# EAGLE design toslink-shield-2 (EAGLE 7.5.0)
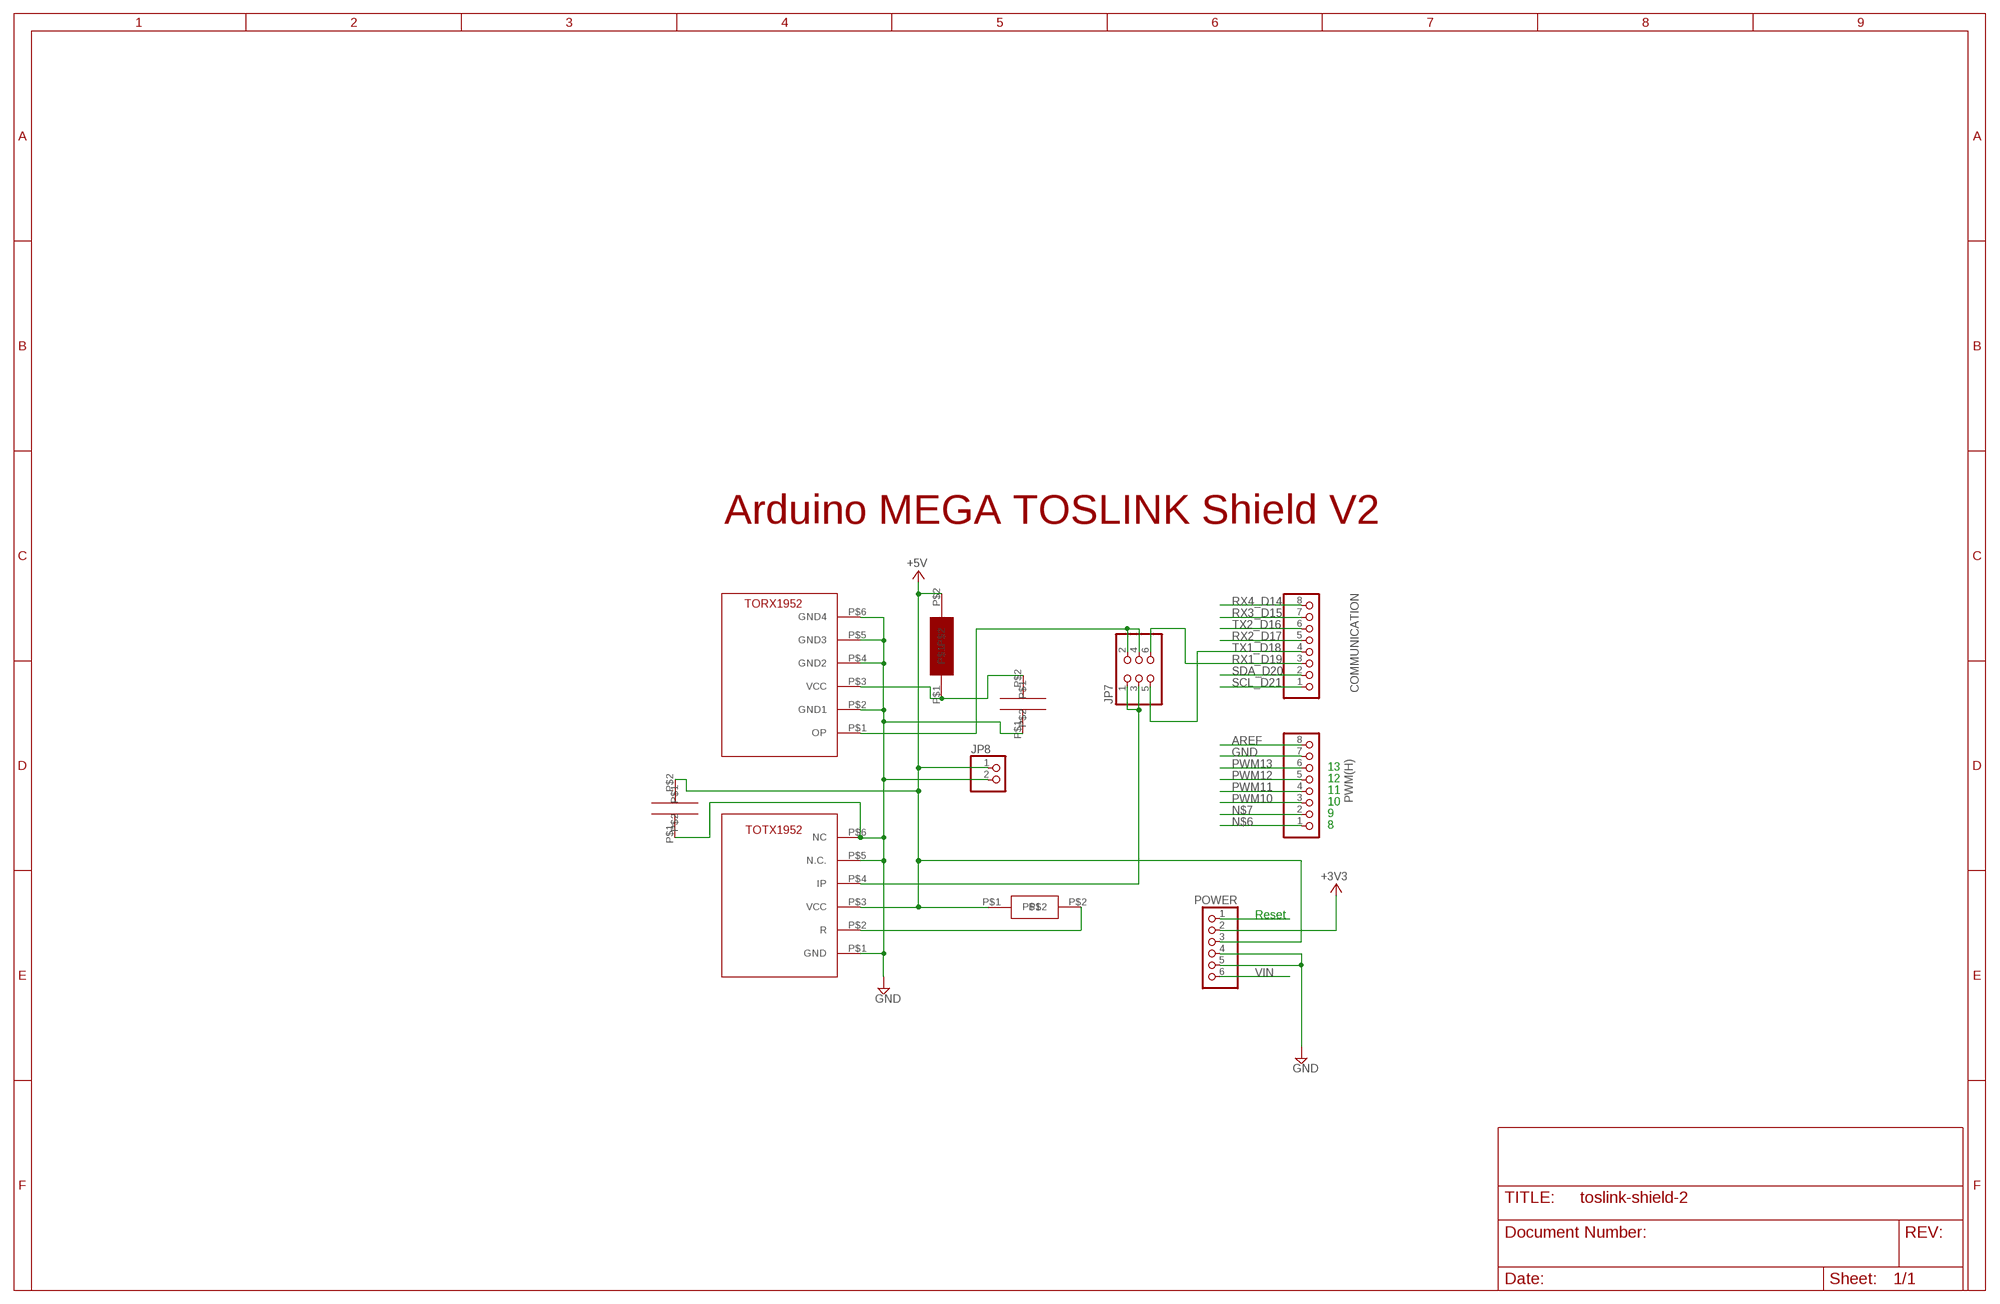
[diagram p0: schematic, sheet 1]

## Parts
COMMUNICATION  PINHD-1X8  [1X08]
JP7  PINHD-2X3  [2X03]
JP8  PINHD-1X2  [1X02]
POWER  PINHD-1X6  [1X06]
PWM(H)  PINHD-1X8  [1X08]
U$1  TORX1952  [TORX1952]
U$2  TOTX1952  [TOTX1952]
U$3  47uH  L-0.1  [L-0.1]
U$4  100nF  C-0.1  [C-0.1]
U$5  C-0.1  [C-0.1]
U$6  -0.2  [R-0.2]

## Nets
+3V3 [power]: POWER.2
AREF: PWM(H).8
GND [gnd]: JP8.2 POWER.4 POWER.5 PWM(H).7 U$1.P$2(GND1) U$1.P$4(GND2) U$1.P$5(GND3) U$1.P$6(GND4) U$2.P$1(GND) U$2.P$5(N.C.) U$2.P$6(NC) U$4.P$1 U$5.P$1
N$1: JP7.2 JP7.4 U$1.P$1(OP)
N$2: JP7.1 JP7.3 U$2.P$4(IP)
N$3: U$2.P$2(R) U$6.P$2
N$4: U$1.P$3(VCC) U$3.P$1 U$4.P$2
N$5: JP8.1 POWER.3 U$2.P$3(VCC) U$3.P$2 U$5.P$2 U$6.P$1
N$6: PWM(H).1
N$7: PWM(H).2
PWM10: PWM(H).3
PWM11: PWM(H).4
PWM12: PWM(H).5
PWM13: PWM(H).6
RESET: POWER.1
RX1_D19: COMMUNICATION.3 JP7.6
RX2_D17: COMMUNICATION.5
RX3_D15: COMMUNICATION.7
RX4_D14: COMMUNICATION.8
SCL_D21: COMMUNICATION.1
SDA_D20: COMMUNICATION.2
TX1_D18: COMMUNICATION.4 JP7.5
TX2_D16: COMMUNICATION.6
VIN [power]: POWER.6

## Notes on the sheet
- Arduino MEGA TOSLINK Shield V2
- 13
- 12
- 11
- 10
- 9
- 8
- Reset

## Library data of the parts
COMMUNICATION PWM(H) = pinhead:PINHD-1X8: PIN HEADER
JP7 = opto:PINHD-2X3: PIN HEADER
JP8 = opto:PINHD-1X2: PIN HEADER
POWER = pinhead:PINHD-1X6: PIN HEADER
U$1 = opto:TORX1952
U$2 = opto:TOTX1952
U$3 = opto:L-0.1
U$4 U$5 = opto:C-0.1
U$6 = opto:-0.2

## Net classes
0 default: width 0.203 mm, drill 0.406 mm, clearance 0.203 mm
1 power: width 0.61 mm, drill 0.711 mm, clearance 0.203 mm
2 gnd: width 0.305 mm, drill 0.711 mm, clearance 0.203 mm
3 usbvcc: width 0.508 mm, drill 0.711 mm, clearance 0.203 mm

## Board
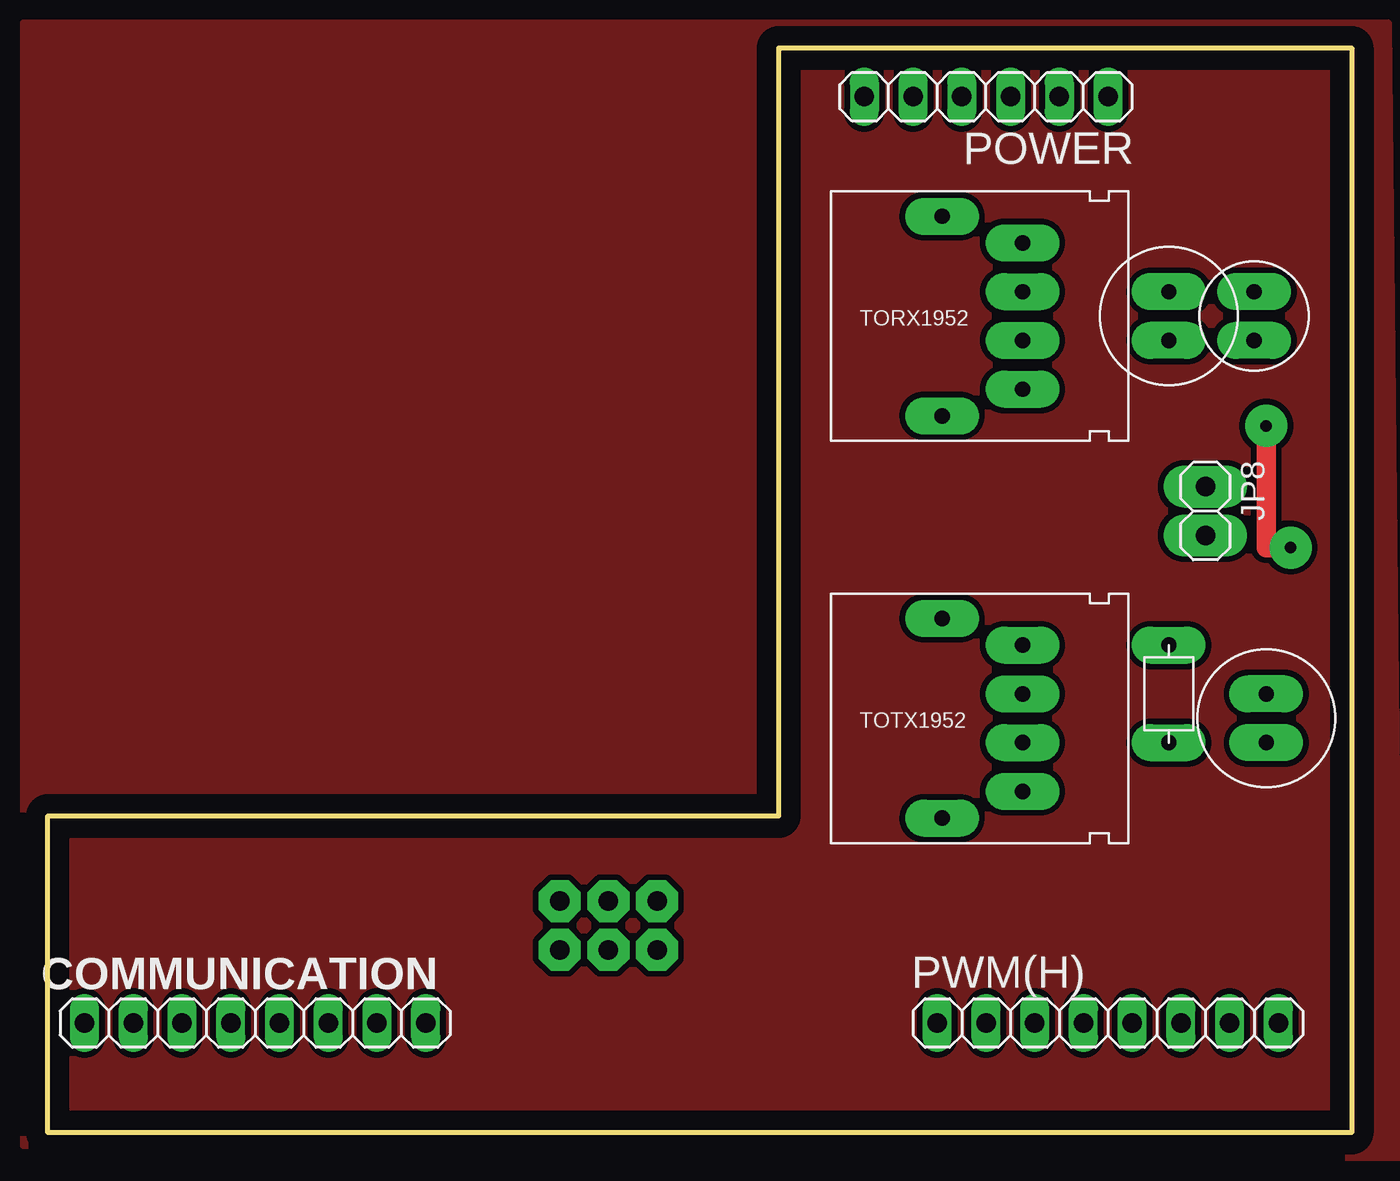
[diagram p1: board, top side]
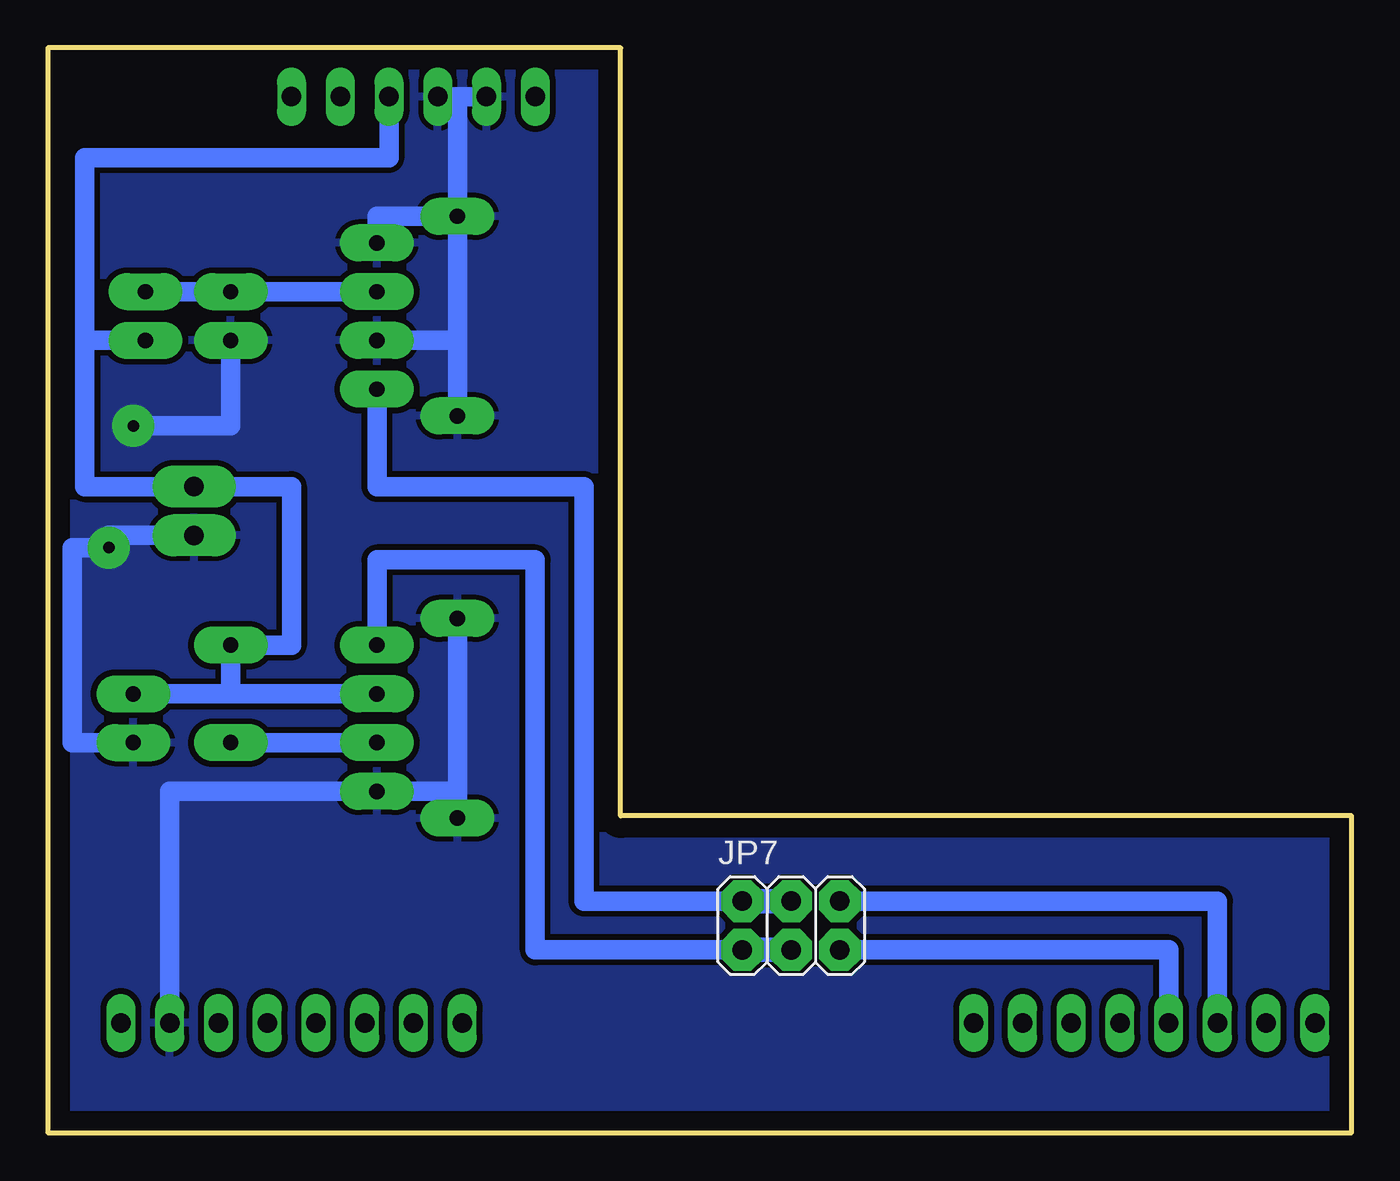
[diagram p2: board, bottom side, seen from below]

Size 67.94 x 56.52 mm. Coordinates in mm from the lower left corner, seen from the top.
Outline: 0,0 67.94,0 67.94,56.52 38.1,56.52 38.1,16.51 0,16.51 0,0
Outline: 0,1.27 0,0
Copper layers (1*16): Top 0.035mm / dielectric 1.5mm / Bottom 0.035mm
Design rules "default *": minimum track width 10mil, minimum drill 24mil, track to track 12mil, track to pad 12mil, pad to pad 12mil, via to via 12mil, smd to smd 8mil, copper to edge 40mil, drill to drill 8mil, minimum pad ring 10mil, minimum via ring 8mil, stop-mask expansion 4mil, vias tented up to drill 0mil, thermal gap 10mil

### Footprints (pad centres in the part's own frame; a part is rotated, then mirrored left to right if it is on the bottom)
1X08 = drill 1.016 long: 1 -8.89,0; 2 -6.35,0; 3 -3.81,0; 4 -1.27,0; 5 1.27,0; 6 3.81,0; 7 6.35,0; 8 8.89,0
2X03 = drill 1.016 pad 2.184 octagon: 1 -2.54,-1.27; 2 -2.54,1.27; 3 0,-1.27; 4 0,1.27; 5 2.54,-1.27; 6 2.54,1.27
1X02 = drill 1.016 pad 2.184 long: 1 -1.27,0; 2 1.27,0
1X06 = drill 1.016 long: 1 -6.35,0; 2 -3.81,0; 3 -1.27,0; 4 1.27,0; 5 3.81,0; 6 6.35,0
TORX1952 = drill 0.8 pad 1.93 long: P$1 -7.62,-2.54; P$2 -7.62,0; P$3 -7.62,2.54; P$4 -7.62,5.08; P$5 -11.82,6.47; P$6 -11.82,-3.93
TOTX1952 = drill 0.8 pad 1.93 long: P$1 0,-3.81; P$2 0,-1.27; P$3 0,1.27; P$4 0,3.81; P$5 -4.2,5.2; P$6 -4.2,-5.2
L-0.1 = drill 0.8 pad 1.93 long: P$1 0,-1.27; P$2 0,1.27
C-0.1 = drill 0.8 pad 1.93 long: P$1 0,1.27; P$2 0,-1.27
R-0.2 = drill 0.8 pad 1.93 long: P$1 0,2.54; P$2 0,-2.54

### Placement (x,y rotation side)
COMMUNICATION  10.79,5.71 0 top
JP7  29.21,10.79 0 bottom
JP8  60.33,32.38 270 top
POWER  48.9,53.98 180 top
PWM(H)  55.24,5.71 0 top
U$1  58.42,41.27 0 top
U$2  50.8,21.59 0 top
U$3  62.87,42.55 180 top
U$4  58.42,42.55 180 top
U$5  63.5,21.59 180 top
U$6  58.42,22.86 0 top

### Tracks (layer width: path | path; a pad name or v marks a point on that pad's centre or on a via)
+5V
  pour Top: -1.27,57.78 -1.27,-0.64 70.48,-1.27 69.85,57.78
GND  (via drill 0.6 pad 2.18)
  Top 1.016: v64.77,30.48 63.5,30.48 v63.5,36.83
  Bottom 1.016: POWER.5 POWER.4 46.6,53.98 U$1.P$5 | U$1.P$5 50.8,47.74 U$1.P$4 | U$1.P$2 46.6,41.27 | 46.6,41.27 U$1.P$5 | 46.6,41.27 U$1.P$6 | PWM(H).7 61.59,17.78 U$2.P$1 46.6,17.78 | U$2.P$5 46.6,17.78 | 46.6,17.78 U$2.P$6 | U$5.P$1 66.67,20.32 66.67,30.48 v64.77,30.48 64.77,31.11 JP8.2 | v63.5,36.83 58.42,36.83 U$4.P$1
  pour Bottom: -1.27,57.78 69.85,57.78 70.48,-1.27 -1.27,-0.64
N$1
  Bottom 1.016: JP7.2 40.01,12.06 40.01,33.66 50.8,33.66 U$1.P$1
  Bottom 1.27: JP7.2 JP7.4
N$2
  Bottom 1.016: JP7.1 42.55,9.53 42.55,29.84 50.8,29.84 U$2.P$4
  Bottom 1.27: JP7.3 JP7.1
N$3
  Bottom 1.016: U$2.P$2 U$6.P$2
N$4
  Bottom 1.016: U$1.P$3 U$4.P$2 U$3.P$1
N$5
  Bottom 1.016: U$5.P$2 58.42,22.86 | 58.42,22.86 U$2.P$3 | 58.42,22.86 U$6.P$1 55.24,25.4 55.24,33.66 JP8.1 66.04,33.66 66.04,41.27 | POWER.3 50.16,50.8 66.04,50.8 66.04,41.27 | U$3.P$2 66.04,41.27
RX1_D19
  Bottom 1.016: COMMUNICATION.3 6.99,12.06 JP7.6
TX1_D18
  Bottom 1.016: COMMUNICATION.4 9.53,9.53 JP7.5